# Altium schematic sheet Power.SchDoc
size A
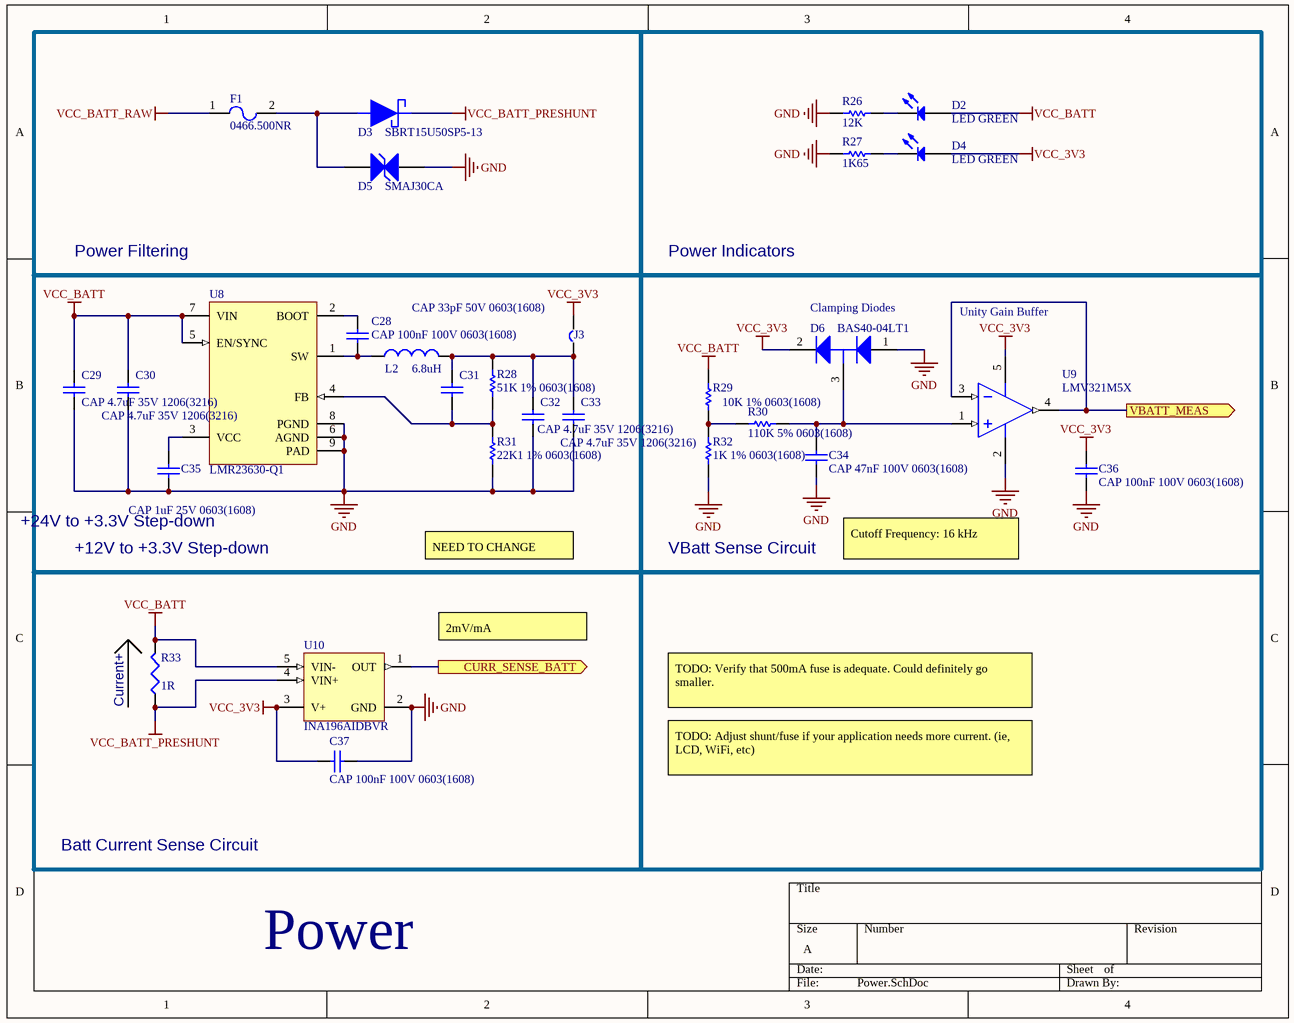
[diagram p0: Power.SchDoc]

## Parts
C28  CAP 100nF 100V 0603(1608)  [CAPC0603(1608)100_L]
C29  CAP 4.7uF 35V 1206(3216)  [CAPC1206(3216)190_L]
C30  CAP 4.7uF 35V 1206(3216)  [CAPC1206(3216)190_L]
C31  CAP 33pF 50V 0603(1608)  [CAPC0603(1608)100_M]
C32  CAP 4.7uF 35V 1206(3216)  [CAPC1206(3216)190_L]
C33  CAP 4.7uF 35V 1206(3216)  [CAPC1206(3216)190_L]
C34  CAP 47nF 100V 0603(1608)  [CAPC0603(1608)100_N]
C35  CAP 1uF 25V 0603(1608)  [CAPC0603(1608)100_L]
C36  CAP 100nF 100V 0603(1608)  [CAPC0603(1608)100_L]
C37  CAP 100nF 100V 0603(1608)  [CAPC0603(1608)100_L]
D2  LED GREEN  [LED_0805]
D3  SBRT15U50SP5-13  [SBRT15U50SP5-13]
D4  LED GREEN  [LED_0805]
D5  SMAJ30CA  [LFUS-DO-214AC-A-2_V]
D6  BAS40-04LT1  [ONSC-SOT-23-3-318-08_V]
F1  0466.500NR  [0466.500NR]
J3  (Open)  [Solder Jumper]  (value not drawn)  (no BOM)
L2  6.8uH  [BOURNS SRP5030T]
R26  12K  [RESC0603(1608)_N]
R27  1K65  [RESC0603(1608)_N]
R28  51K 1% 0603(1608)  [RESC0603(1608)_N]
R29  10K 1% 0603(1608)  [RESC0603(1608)_N]
R30  110K 5% 0603(1608)  [RESC0603(1608)_M]
R31  22K1 1% 0603(1608)  [RESC0603(1608)_N]
R32  1K 1% 0603(1608)  [RESC0603(1608)_M]
R33  value 1R  [C1206]
U8  LMR23630-Q1  [DDA0008E_N]
U9  LMV321M5X  [DBV0005A_N]
U10  INA196AIDBVR  [DBV0005A_L]

## Blocks framed on the sheet
Power Filtering: D3 D5 F1
Power Indicators: D2 D4 R26 R27
+12V to +3.3V Step-down: C28-C33 C35 J3 L2 R28 R31 U8
VBatt Sense Circuit: C34 C36 D6 R29 R30 R32 U9
Batt Current Sense Circuit: C37 R33 U10

## Ports
CURR_SENSE_BATT (out), VBATT_MEAS (out)

## Nets
GND: C29.1 C30.1 C32.1 C33.1 C34.1 C35.1 C36.2 C37.1 D5.2(A) D6.1(A) R26.1 R27.1 R31.1 R32.1 U8.6(AGND) U8.8(PGND) U8.9(PAD) U9.2(V-) U10.2(GND)
VCC_3V3: C36.1 C37.2 D4.2(A) D6.2(K) J3.2 U9.5(V+) U10.3(V+)
VCC_BATT: C29.2 C30.2 D2.2(A) R29.2 R33.2 U8.5(EN/SYNC) U8.7(VIN) U10.5(VIN-)
VCC_BATT_PRESHUNT: D3.2 R33.1 U10.4(VIN+)
VCC_BATT_RAW: F1.1
CURR_SENSE_BATT: U10.1(OUT) ; port CURR_SENSE_BATT
VBATT_MEAS: U9.3(IN-) U9.4(OUT) ; port VBATT_MEAS
NetC28_1: C28.1 L2.1 U8.1(SW)
NetC28_2: C28.2 U8.2(BOOT)
NetC31_1: C31.1 R28.1 R31.2 U8.4(FB)
NetC31_2: C31.2 C32.2 C33.2 J3.1 L2.2 R28.2
NetC34_2: C34.2 D6.3(K/A) R30.2 U9.1(IN+)
NetC35_2: C35.2 U8.3(VCC)
NetD2_1: D2.1(K) R26.2
NetD3_1: D3.1 D5.1(A) F1.2
NetD4_1: D4.1(K) R27.2
NetR29_1: R29.1 R30.1 R32.2

## Notes on the sheet
- (near D6) Clamping Diodes
- Unity Gain Buffer
- (near C35) +24V to +3.3V Step-down
- NEED TO CHANGE VALUES
- Cutoff Frequency: 16 kHz
- 2mV/mA
- (near R33) Current+
- TODO: Verify that 500mA fuse is adequate. Could definitely go smaller.
- TODO: Adjust shunt/fuse if your application needs more current. (ie, LCD, WiFi, etc)
- Power

## Library data of the parts
C28 C36 C37 = CMP-1035-02595-1: CAP 100nF 100V ±10% 0603 (1608 Metric) Thickness 1mm SMD; Tolerance: Â±10%; Case-EIA: 0603; Case-Metric: 1608; Rated Voltage: 100 V; Value: 100nF; Technology: SMT; Max Thickness: 1 mm
C29 C30 C32 C33 = CMP-1037-04922-1: CAP 4.7uF 35V ±10% 1206 (3216 Metric) Thickness 1.9mm SMD; Case-EIA: 1206; Tolerance: Â±10%; Case-Metric: 3216; Rated Voltage: 35 V; Technology: SMT; Value: 4.7uF; Max Thickness: 1.9 mm
C31 = CMP-1035-00943-1: CAP 33pF 50V ±5% 0603 (1608 Metric) Thickness 1mm SMD; Tolerance: Â±5%; Case-EIA: 0603; Case-Metric: 1608; Rated Voltage: 50 V; Max Thickness: 1 mm; Technology: SMT; Value: 33pF
C34 = CMP-1035-02516-1: CAP 47nF 100V ±10% 0603 (1608 Metric) Thickness 1mm SMD; Case-Metric: 1608; Case-EIA: 0603; Tolerance: Â±10%; Rated Voltage: 100 V; Value: 47nF; Max Thickness: 1 mm; Technology: SMT
C35 = CMP-1035-02740-1: CAP 1uF 25V ±10% 0603 (1608 Metric) Thickness 1mm SMD; Tolerance: Â±10%; Case-Metric: 1608; Case-EIA: 0603; Technology: SMT; Rated Voltage: 25 V; Max Thickness: 1 mm; Value: 1uF
D2 D4 = LED0: led; Manufacturer: Lite-On Inc.; Manufacturer Part Number: LTST-C171KGKT; Lens Color: Colorless; Lens Transparency: Clear; Millicandela Rating: 35mcd; Lens Style/Size: Rectangle with Flat Top, 1.40mm x 1.25mm; Voltage - Forward (Vf) (Typ): 2V; Current - Test: 20mA; Viewing Angle: 130°; Wavelength - Dominant: 571nm; Wavelength - Peak: 574nm; Supplier 1: Digi-Key; Supplier Part Number 1: 160-1426-1-ND; RoHS: RoHS Compliant; Category: Optoelectronics; Stock 1: 350441; Pricing 1: 1=0.31, 10=0.225, 25=0.1656, 100=0.1183, 250=0.0804, 500=0.07096, 1000=0.05558 (USD); Packaging: Cut Tape (CT); Part Status: Active; Color: Green; Mounting Type: Surface Mount; Features: -; Package / Case: 0805 (2012 Metric); Size / Dimension: 2.00mm L x 1.25mm W; Height (Max): 0.90mm; ComponentLink1URL: http://optoelectronics.liteon.com/upload/download/DS22-2000-118/LTST-C171KGKT.pdf; ComponentLink1Description: http://optoelectronics.liteon.com/upload/download/DS22-2000-118/LTST-C171KGKT.pdf
D5 = CMP-2000-07088-1: Transient Voltage Suppression Diode, 30 V, -65 to 150 degC, 2-Pin SMD, RoHS, Tape and Reel; Manufacturer: Littelfuse-Inc.; Current - Peak Pulse (10/1000µs): 8.3A; Power - Peak Pulse: 400W; Voltage - Breakdown (Min): 33.3V; Bidirectional Channels: 1; Power Line Protection: No; Voltage - Clamping (Max) @ Ipp: 48.4V; Voltage - Reverse Standoff (Typ): 30V; Type: Zener; Category: CircuitProtection; Datasheet Version: 11/2015; Package Description: 2-Pin Surface Mount Device, Body 4.295 x 2.595 mm; Family: TVS-Diodes; Manufacturer URL: http://www.littelfuse.com/; Series: SMAJ; Package / Case: DO-214AC,SMA; Capacitance @ Frequency: -; Package Reference: DO-214AC; Packaging: Digi-Reel®; Applications: GeneralPurpose; Mounting Technology: SurfaceMount; Mounting Type: SurfaceMount; Unidirectional Channels: -; Supplier Device Package: DO-214AC(SMA); Operating Temperature: -55°C~150°C(TJ); Datasheet URL: http://www.littelfuse.com/~/media/electronics/datasheets/tvs_diodes/littelfuse_tvs_diode_smaj_datasheet.pdf.pdf
D6 = CMP-1055-00528-1: Dual Series Schottky Barrier Diodes, 3-Pin SOT-23, Tape and Reel; Manufacturer: On Semiconductor; PartNumber: BAS40-04LT1; Packing: Tape and Reel; PackageReference: SOT-23-3-318-08; ComponentLink1URL: http://www.onsemi.com/; PackageVersion: Rev. AP, 11/2009; ComponentLink2Description: Datasheet; Mounting Technology: Surface Mount; Configuration: Series; ComponentLink1Description: Manufacturer URL; RoHS: FALSE; ComponentLink3Description: Package Specification; ComponentLink2URL: http://www.onsemi.cn/pub_link/Collateral/BAS40-04LT1-D.PDF; DatasheetVersion: Rev. 11; PackageDescription: 3-Pin Small Outline Transistor, Body 2.92 x 1.3 mm, Pitch 0.95 mm; ComponentLink3URL: http://www.onsemi.cn/pub_link/Collateral/318-08.PDF
F1 = 0466.500NR: FUSE BOARD MOUNT 500MA 63VAC/VDC; Supplier: DigiKey; Part Number: 0466.500NR; Supplier Part Number: F1454CT-ND; Datasheet URL: http://www.littelfuse.com/~/media/electronics/datasheets/fuses/littelfuse_fuse_466_datasheet.pdf.pdf
J3 = Jumper
L2 = SRP5030TA: Manufacturer: Bourns Inc.; Manufacturer Part Number: SRP5030TA-6R8M; Type: Wirewound; Material - Core: Carbonyl Powder; Tolerance: ±20%; Shielding: Shielded; DC Resistance (DCR): 76.2 mOhm Max; Q @ Freq: 15 @ 100kHz; Supplier 1: Digi-Key; RoHS: RoHS Compliant; Category: Inductors, Coils, Chokes; Stock 1: 5626; Pricing 1: 1=1.51, 10=1.397, 100=0.9781, 500=0.79178, 1000=0.72191 (USD); Packaging: Cut Tape (CT); Part Status: Active; Ratings: AEC-Q200; Operating Temperature: -40°C ~ 150°C; Mounting Type: Surface Mount; Package / Case: Nonstandard; Supplier Device Package: -; Size / Dimension: 0.224" L x 0.205" W (5.70mm x 5.20mm); Height - Seated (Max): 0.118" (3.00mm); ComponentLink1URL: http://www.bourns.com/docs/Product-Datasheets/SRP5030TA.pdf; ComponentLink1Description: http://www.bourns.com/docs/Product-Datasheets/SRP5030TA.pdf; Supplier Part Number 1: SRP5030TA-6R8MCT-ND
R26 R27 = CMP-1012-00050-1: 100R 0.1W 5% 0603 (1608 Metric)  SMD; Case-EIA: 0603; Value: 100.00 Ohm; Case-Metric: 1608; Tolerance: 5 %; Technology: SMT; Power: 0.1 W
R28 = CMP-1012-00703-1: 51K 0.1W 1% 0603 (1608 Metric)  SMD; Case-EIA: 0603; Case-Metric: 1608; Value: 51000.00 Ohm; Tolerance: 1 %; Technology: SMT; Power: 0.1 W
R29 = CMP-1012-00623-1: 10K 0.1W 1% 0603 (1608 Metric)  SMD; Value: 10000.00 Ohm; Case-EIA: 0603; Case-Metric: 1608; Power: 0.1 W; Tolerance: 1 %; Technology: SMT
R30 = CMP-1012-00123-1: 110K 0.1W 5% 0603 (1608 Metric)  SMD; Value: 110000.00 Ohm; Case-Metric: 1608; Case-EIA: 0603; Tolerance: 5 %; Power: 0.1 W; Technology: SMT
R31 = CMP-1012-00660-1: 22K1 0.1W 1% 0603 (1608 Metric)  SMD; Case-EIA: 0603; Case-Metric: 1608; Value: 22100.00 Ohm; Tolerance: 1 %; Power: 0.1 W; Technology: SMT
R32 = CMP-1012-00510-1: 1K 0.1W 1% 0603 (1608 Metric)  SMD; Case-Metric: 1608; Case-EIA: 0603; Value: 1000.00 Ohm; Technology: SMT; Tolerance: 1 %; Power: 0.1 W
R33 = Res3: Resistor; Manufacturer 1: Susumu; Manufacturer Part Number 1: RL1632R-1R00-F; Power Rating: 500mW; Tolerance: 1%; Temperature Coefficient: 100ppm/°C; Published: 8-Jun-2000; LatestRevisionDate: 29-May-2009; LatestRevisionNote: IPC-7351 Footprint Added.; PackageReference: J1-0603; Publisher: Altium Limited; PackageDescription: Chip Resistor; Supplier 1: Digi-Key; Supplier Part Number 1: RL16R1.0FCT-ND; Stock 1: 37831; Pricing 1: 1=0.68, 10=0.485, 25=0.3784, 50=0.3202, 100=0.2523, 250=0.2134, 500=0.1746, 1000=0.1358 (USD); Case/Package: 1206; Weight: 0.000571oz; Case Code (Metric): 3216; Case Code (Imperial): 1206; Min Operating Temperature: -55°C; Max Operating Temperature: 125°C; Package Quantity: 1; Resistance: 1R; Packaging: Tape and Reel; Composition: Thin Film; Number of Terminations: 2; Termination: SMD/SMT; Max Power Dissipation: 500mW; Length: 0.126inch; Height: 0.026inch; Width: 0.063inch; Lead Free: Lead Free; ComponentLink1URL: https://datasheet.ciiva.com/2490/rl-data-sheet-2490384.pdf; ComponentLink1Description: https://datasheet.ciiva.com/2490/rl-data-sheet-2490384.pdf; ComponentLink2URL: https://datasheet.ciiva.com/12838/e-15-16-12838646.pdf; ComponentLink2Description: https://datasheet.ciiva.com/12838/e-15-16-12838646.pdf; ComponentLink3URL: https://datasheet.ciiva.com/2490/rl-data-sheet-2490382.pdf; ComponentLink3Description: https://datasheet.ciiva.com/2490/rl-data-sheet-2490382.pdf; ComponentLink4URL: https://datasheet.ciiva.com/2490/rl-data-sheet-2490383.pdf; ComponentLink4Description: https://datasheet.ciiva.com/2490/rl-data-sheet-2490383.pdf
U8 = LMR23630-Q1: Manufacturer: Texas Instruments; Manufacturer Part Number: LMR23630AFQDDARQ1; Function: Step-Down; Output Configuration: Positive; Topology: Buck; Output Type: Adjustable; Number of Outputs: 1; Voltage - Input (Min): 4.5V; Voltage - Input (Max): 36V; Voltage - Output (Min/Fixed): 1V; Voltage - Output (Max): 28V; Current - Output: 3A; Frequency - Switching: 400kHz; Synchronous Rectifier: Yes; Supplier 1: Digi-Key; Supplier Part Number 1: 296-45260-6-ND; Stock 1: 1636; Pricing 1: 1=3.97, 10=3.564, 100=2.9204, 500=2.48604, 1000=2.09667 (USD); RoHS: RoHS Compliant; Category: Integrated Circuits (ICs); Packaging: Digi-Reel®; Part Status: Active; Operating Temperature: -40°C ~ 125°C (TJ); Mounting Type: Surface Mount; Package / Case: 8-SOIC (0.154", 3.90mm Width) Exposed Pad; Supplier Device Package: 8-SO PowerPad; ComponentLink1URL: http://www.ti.com/lit/ds/symlink/lmr23630-q1.pdf; ComponentLink1Description: http://www.ti.com/lit/ds/symlink/lmr23630-q1.pdf
U9 = CMP-0055-01048-3: General Purpose, Low Voltage, Rail-to-Rail Output Operational Amplifiers, 5-pin SOT-23; Manufacturer: Texas Instruments; PackageTopMarking: A13*XTT; PowerWise: N; ComponentLink1Description: Datasheet URL; CompType: Amplifiers; ComponentLink1URL: http://www.ti.com/general/docs/lit/getliterature.tsp?genericPartNumber=LMV321-N&fileType=pdf; PinCount: 5; PackageDescription: Molded SOT-23, .115 x .063 x .040 in Body, 5 Lead, .0375 in Pitch; RoHS: N; Package Reference: DBV0005A
U10 = CMP-0704-00014-2: Voltage Output High-Side Measurement Current Shunt Monitor, 2.7 to 18 V, -40 to 125 degC, 5-pin SOT23 (DBV5), Green (RoHS & no Sb/Br); Manufacturer: Texas Instruments; Common Mode Range(Max)(V): 80; Rating: Catalog; Input Offset (+/-)(Max)(uV): 2000; Vs(Min)(V): 2.7; Gain(V/V): 20; Vs(Max)(V): 18; Small-Signal Bandwidth(Typ)(MHz): 0.5; Quiescent Current (+/-)(Typ)(mA): 0.7; Common Mode Range(Min)(V): -16; PartNumber: INA196AIDBVR; SubFamily: Current Shunt Monitor; ComponentLink2Description: Datasheet; ComponentLink1Description: Manufacturer URL; CMRR(Min)(dB): 80; PackageVersion: 4073253-4/K, 03/2006; Output Type: Voltage; ComponentLink3Description: Package Specification; DatasheetVersion: SBOS307F; ComponentLink3URL: http://www.ti.com/lit/ml/mpds018j/mpds018j.pdf; Mounting Technology: Surface Mount; ComponentLink2URL: http://www.ti.com/general/docs/lit/getliterature.tsp?genericPartNumber=INA196&fileType=pdf; PackageReference: DBV0005A; ComponentLink1URL: http://www.ti.com/; Eco-Plan: Green (RoHS & no Sb/Br); Code_JEDEC: MO-178; PackageDescription: 5-Pin Plastic Small Outline, Body 1.6 x 2.9 mm, Pitch 0.95 mm
D3 = SBRT15U50SP5-13: Supplier 1: Digi-Key; Supplier Part Number 1: SBRT15U50SP5-13DICT-ND